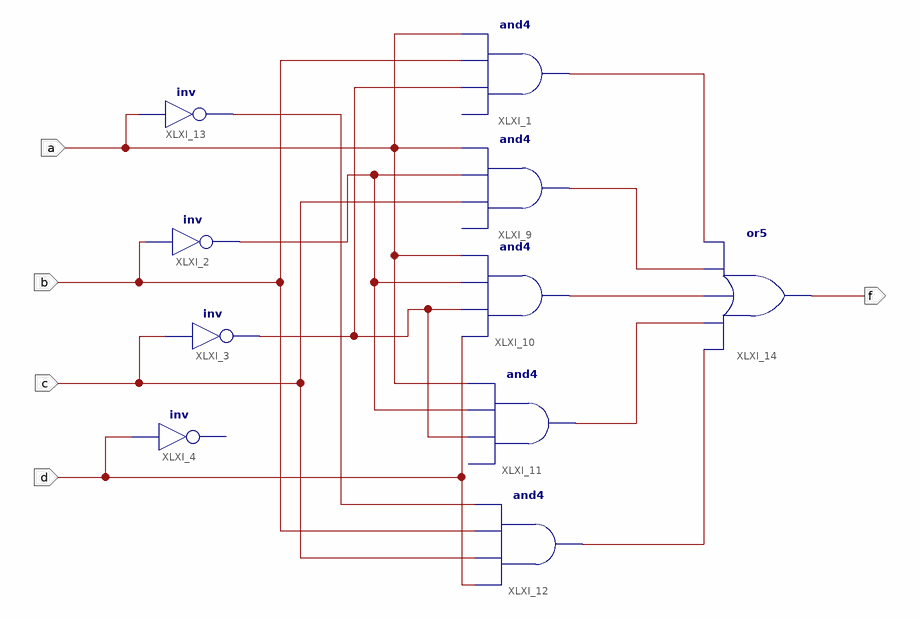
[diagram p0: schematic sheet 1]
// Xilinx ISE schematic schematico.sch (spartan3e) as structural Verilog: 10 symbols, 5 ports
module schematico (
  input  a,
  input  b,
  input  c,
  input  d,
  output f
);

  wire XLXN_19, XLXN_56, XLXN_62, XLXN_100, XLXN_101, XLXN_102, XLXN_103, XLXN_104;

  and XLXI_1 (XLXN_100, XLXN_19, b, a);  // open: I0
  not XLXI_2 (XLXN_56, b);
  not XLXI_3 (XLXN_19, c);
  // inv XLXI_4 has open pins: I=d, O=open
  and XLXI_9 (XLXN_101, c, XLXN_56, a);  // open: I0
  and XLXI_10 (XLXN_102, d, XLXN_19, XLXN_56, a);
  and XLXI_11 (XLXN_103, XLXN_19, XLXN_56, a);  // open: I0
  and XLXI_12 (XLXN_104, d, c, b, XLXN_62);
  not XLXI_13 (XLXN_62, a);
  or XLXI_14 (f, XLXN_104, XLXN_103, XLXN_102, XLXN_101, XLXN_100);
endmodule
